# Altium schematic sheet BEAMFORMER.SchDoc (part 3 of 3)
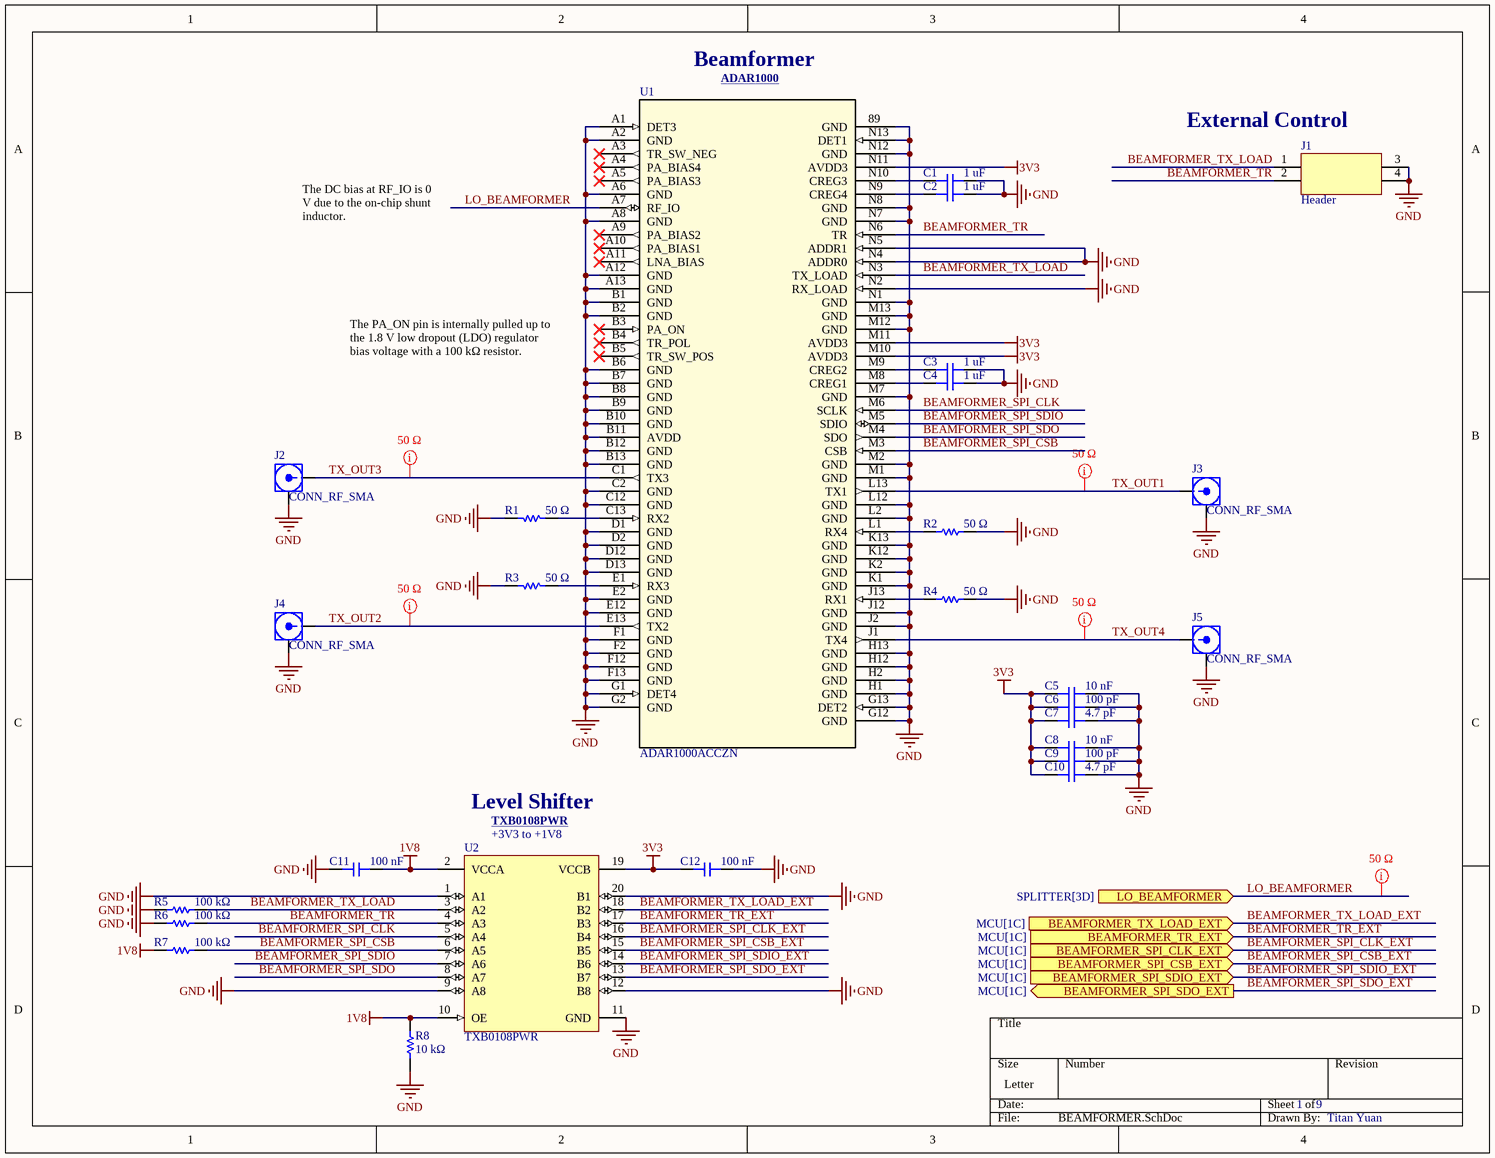
[diagram p2: BEAMFORMER.SchDoc]

## Library data of the parts (continued)
R8 = RES: Res Thick Film 0402 10K Ohm 1% 0.063W(1/16W) ±100ppm/C Pad SMD T/R; Manufacturer: Yageo; Manufacturer Part Number: RC0402FR-0710KL; Power Dissipation: 62.5mW; Power Rating: 63mW; Value: 10kΩ; Temperature Coefficient: 100ppm/°C; Voltage Rating (DC): 50V; Tolerance: 1%; Package Size: 0402; Supplier: DigiKey; Supplier Part Number: 311-10.0KLRCT-ND; RoHS: Compliant; Category: Chip SMD Resistors; Stock: 9059080; Pricing: 1=0.1, 10=0.012, 25=0.0092, 50=0.0062, 100=0.0056, 250=0.00472, 500=0.00328, 10000=0.00204, 20000=0.00153 (USD); Case/Package: 0402; Case Code (Imperial): 0402; Case Code (Metric): 0402; China RoHS: Non-Compliant; Composition: Thick Film; Country of Origin: Mainland China, Taiwan; Depth: 500µm; Export Control Classification Number (ECCN) Code: EAR99; Height: 350µm; Harmonized Tariff Schedule (HTS) Code: 8533.21.00.30; Introduction Date: 2004-10-04; Lead Free: Lead Free; Lead Pitch: 200µm; Length: 1mm; Lifecycle Status: Production; Max Operating Temperature: 155°C; Military Standard: Not; Min Operating Temperature: -55°C; Mounting Technology: Surface Mount; Pins: 2; Number of Terminals: 2; Number of Terminations: 2; Packaging: Tape & Reel; REACH SVHC: Yes; Schedule B: 8533210045, 8533210045|8533210045|8533210045|8533210045|8533210045|8533210045|8533210045|8533210045|8533210045|8533210045|8533210045|8533210045|8533210045|8533210045, 8533210045|8533210045|8533210045|8533210045|8533210045|8533210045|8533210045|8533210045|8533210045|8533210045|8533210045|8533210045|8533210045|8533210045|8533210045, 8533210045|8533210045|8533210045|8533210045|8533210045|8533210045|8533210045|8533210045|8533210045|8533210045|8533210045|8533210045|8533210045|8533210045|8533210045|8533210045; Termination: SMD/SMT; Width: 500µm; Working Voltage: 50V; ComponentLink1URL: https://datasheet.octopart.com:443/RC0402FR-0710KL-Yageo-datasheet-175887523.pdf?src-supplier=Newark; ComponentLink1Description: https://datasheet.octopart.com:443/RC0402FR-0710KL-Yageo-datasheet-175887523.pdf?src-supplier=Newark; ComponentLink2URL: https://datasheet.octopart.com:443/RC0402FR-0710KL-Yageo-datasheet-12531192.pdf?src-supplier=Newark; ComponentLink2Description: https://datasheet.octopart.com:443/RC0402FR-0710KL-Yageo-datasheet-12531192.pdf?src-supplier=Newark; ComponentLink3URL: https://datasheet.octopart.com:443/RC0402FR-0710KL-Yageo-datasheet-8324527.pdf?src-supplier=Newark; ComponentLink3Description: https://datasheet.octopart.com:443/RC0402FR-0710KL-Yageo-datasheet-8324527.pdf?src-supplier=Newark; ComponentLink4URL: https://datasheet.octopart.com:443/RC0402FR-0710KL-Yageo-datasheet-10408619.pdf?src-supplier=element14+APAC; ComponentLink4Description: https://datasheet.octopart.com:443/RC0402FR-0710KL-Yageo-datasheet-10408619.pdf?src-supplier=element14+APAC; ComponentLink5URL: https://datasheet.octopart.com:443/RC0402FR-0710KL-Yageo-datasheet-62067350.pdf?src-supplier=element14+APAC; ComponentLink5Description: https://datasheet.octopart.com:443/RC0402FR-0710KL-Yageo-datasheet-62067350.pdf?src-supplier=element14+APAC; ComponentLink6URL: https://datasheet.octopart.com:443/RC0402FR-0710KL-Yageo-datasheet-21426659.pdf?src-supplier=element14+APAC; ComponentLink6Description: https://datasheet.octopart.com:443/RC0402FR-0710KL-Yageo-datasheet-21426659.pdf?src-supplier=element14+APAC; ComponentLink7URL: https://datasheet.octopart.com:443/RC0402FR-0710KL-Yageo-datasheet-164759695.pdf?src-supplier=Upverter; ComponentLink7Description: https://datasheet.octopart.com:443/RC0402FR-0710KL-Yageo-datasheet-164759695.pdf?src-supplier=Upverter; ComponentLink8URL: https://datasheet.octopart.com:443/RC0402FR-0710KL-Yageo-datasheet-103092701.pdf?src-supplier=Upverter; ComponentLink8Description: https://datasheet.octopart.com:443/RC0402FR-0710KL-Yageo-datasheet-103092701.pdf?src-supplier=Upverter; ComponentLink9URL: https://sigma.octopart.com:443/138820526/technical_drawing/Yageo-RC0402FR-0710KL.pdf?src-supplier=Upverter; ComponentLink9Description: https://sigma.octopart.com:443/138820526/technical_drawing/Yageo-RC0402FR-0710KL.pdf?src-supplier=Upverter; ComponentLink10URL: https://datasheet.octopart.com:443/RC0402FR-0710KL-Yageo-datasheet-98239111.pdf?src-supplier=Upverter; ComponentLink10Description: https://datasheet.octopart.com:443/RC0402FR-0710KL-Yageo-datasheet-98239111.pdf?src-supplier=Upverter; ComponentLink11URL: https://datasheet.octopart.com:443/RC0402FR-0710KL-Yageo-datasheet-68298067.pdf?src-supplier=Upverter; ComponentLink11Description: https://datasheet.octopart.com:443/RC0402FR-0710KL-Yageo-datasheet-68298067.pdf?src-supplier=Upverter; ComponentLink12URL: https://datasheet.octopart.com:443/RC0402FR-0710KL-Yageo-datasheet-68297981.pdf?src-supplier=Upverter; ComponentLink12Description: https://datasheet.octopart.com:443/RC0402FR-0710KL-Yageo-datasheet-68297981.pdf?src-supplier=Upverter; ComponentLink13URL: https://datasheet.octopart.com:443/RC0402FR-0710KL-Yageo-datasheet-141435361.pdf?src-supplier=Upverter; ComponentLink13Description: https://datasheet.octopart.com:443/RC0402FR-0710KL-Yageo-datasheet-141435361.pdf?src-supplier=Upverter; ComponentLink14URL: https://datasheet.octopart.com:443/RC0402FR-0710KL-Yageo-datasheet-12509768.pdf?src-supplier=Upverter; ComponentLink14Description: https://datasheet.octopart.com:443/RC0402FR-0710KL-Yageo-datasheet-12509768.pdf?src-supplier=Upverter; ComponentLink15URL: https://datasheet.octopart.com:443/RC0402FR-0710KL-Yageo-Group-datasheet-190305687.pdf?src-supplier=Future+Electronics; ComponentLink15Description: https://datasheet.octopart.com:443/RC0402FR-0710KL-Yageo-Group-datasheet-190305687.pdf?src-supplier=Future+Electronics; ComponentLink16URL: https://datasheet.octopart.com:443/RC0402FR-0710KL-Yageo-datasheet-137700087.pdf?src-supplier=Future+Electronics; ComponentLink16Description: https://datasheet.octopart.com:443/RC0402FR-0710KL-Yageo-datasheet-137700087.pdf?src-supplier=Future+Electronics; ComponentLink17URL: https://datasheet.octopart.com:443/RC0402FR-0710KL-Yageo-datasheet-8324255.pdf?src-supplier=Future+Electronics; ComponentLink17Description: https://datasheet.octopart.com:443/RC0402FR-0710KL-Yageo-datasheet-8324255.pdf?src-supplier=Future+Electronics; ComponentLink18URL: https://datasheet.octopart.com:443/RC0402FR-0710KL-Yageo-datasheet-8329306.pdf?src-supplier=element14; ComponentLink18Description: https://datasheet.octopart.com:443/RC0402FR-0710KL-Yageo-datasheet-8329306.pdf?src-supplier=element14; ComponentLink19URL: https://datasheet.octopart.com:443/RC0402FR-0710KL-Yageo-datasheet-505231.pdf?src-supplier=element14; ComponentLink19Description: https://datasheet.octopart.com:443/RC0402FR-0710KL-Yageo-datasheet-505231.pdf?src-supplier=element14; ComponentLink20URL: https://datasheet.octopart.com:443/RC0402FR-0710KL-Yageo-datasheet-175423674.pdf?src-supplier=SOS+electronic; ComponentLink20Description: https://datasheet.octopart.com:443/RC0402FR-0710KL-Yageo-datasheet-175423674.pdf?src-supplier=SOS+electronic; ComponentLink21URL: https://datasheet.octopart.com:443/RC0402FR-0710KL-Yageo-datasheet-79472498.pdf?src-supplier=Megastar; ComponentLink21Description: https://datasheet.octopart.com:443/RC0402FR-0710KL-Yageo-datasheet-79472498.pdf?src-supplier=Megastar; ComponentLink22URL: https://datasheet.octopart.com/RC0402FR-0710KL-Yageo-datasheet-73766026.pdf; ComponentLink22Description: https://datasheet.octopart.com/RC0402FR-0710KL-Yageo-datasheet-73766026.pdf; ComponentLink23URL: http://sigma.octopart.com:80/conflict_mineral_statement/Yageo-company-3.pdf?src-supplier=Compliance+Statements; ComponentLink23Description: http://sigma.octopart.com:80/conflict_mineral_statement/Yageo-company-3.pdf?src-supplier=Compliance+Statements; ComponentLink24URL: http://sigma.octopart.com:80/rohs_statement/Yageo-company-2.pdf?src-supplier=Compliance+Statements; ComponentLink24Description: http://sigma.octopart.com:80/rohs_statement/Yageo-company-2.pdf?src-supplier=Compliance+Statements
U1 = ADAR1000ACCZN: 8 GHz to 16 GHz, 4-Channel, X Band and Ku Band Beamformer; Manufacturer_Name: Analog Devices Inc; Manufacturer: Analog Devices; Type: RF; Copyright: Copyright (C) 2025 Ultra Librarian. All rights reserved.; Manufacturer_Part_Number: ADAR1000ACCZN; RefDes: RefDes; Manufacturer Part Number: ADAR1000ACCZN
U2 = TXB0108PWR: 8-Bit Bidirectional Voltage-Level Shifter with Auto Direction Sensing and +/-15-kV ESD Protect 20-TSSOP -40 to 85; Manufacturer: Texas Instruments; Manufacturer Lifecycle Status: ACTIVE; Manufacturer Package Identifier: PW (R-PDSO-G**); Data Rate: 100Mbps; High Level Output Current: -20µA; Logic Function: Translator; Low Level Output Current: 20µA; Max Supply Voltage: 5.5V; Min Supply Voltage: 1.65V; Number of Bits: 8; Propagation Delay: 4ns; Quiescent Current: 3.5µA; Rise Time: 7.3ns; Topology: Push-Pull; Turn-On Delay Time: 9.5ns; Manufacturer Part Number: TXB0108PWR; Supplier: DigiKey; Supplier Part Number: 296-21527-1-ND; RoHS: Compliant; Category: Voltage Level Shifters; Stock: 22043; Pricing: 1=1.82, 10=1.338, 25=1.2176, 100=1.0851, 250=1.02184, 500=1.01132 (USD); Case/Package: TSSOP; Contact Plating: Gold; Height: 0m; Lead Free: Lead Free; Length: 6.5mm; Lifecycle Status: Production; Max Operating Temperature: 85°C; Min Operating Temperature: -40°C; Mounting Technology: Surface Mount; Number of Channels: 8; Number of Inputs: 8; Pins: 20; Output Current: 20µA; Radiation Hardening: No; REACH SVHC: No; Schedule B: 8542390000, 8542390000|8542390000|8542390000|8542390000|8542390000; Termination: SMD/SMT; Thickness: 1mm; Weight: 76.997305mg; Width: 4.4mm; ComponentLink1URL: https://sigma.octopart.com:443/157851284/technical_drawing/Texas-Instruments-TXB0108PWR.pdf?src-supplier=Texas+Instruments; ComponentLink1Description: https://sigma.octopart.com:443/157851284/technical_drawing/Texas-Instruments-TXB0108PWR.pdf?src-supplier=Texas+Instruments; ComponentLink2URL: https://octopart.com:443/opatz8j6/c1?t=LySuUYxN9QFMmqSZ0iSTBK1M-CfND3iA45F57-rgipnbsICCknTkoBhUukg2AkZDEL0aXzWd55iRogxa7qKL4TXUNFi6ipSyGXAAa9LZBdmP_Kv4vGBHh0qj-vgKaBFsF-d5KwYEI23cSnz-pp69Sgcy-_vsa0CB7mKhHXjctGx33TVX4QZBqIYpXxZkCgRNByv7fiJueXud0UX45YityO0p_-WYUGRJV_eJOGa4Ay7QQ8FZc3uEUNlVrkxXjQZMNFnbfnrSKCgesFBqhoNiKT25AC3yNUdmgJ7FLN5_z4zOzP0RR75DYkH4GMBnBzaYVRF7L7HNXVjS4Tp9-MFjD_sEQ-aCybQglHE52PnZL4JsgTDjFwelFwDtaMk_UKSdWjy_&src-supplier=Texas+Instruments; ComponentLink2Description: https://octopart.com:443/opatz8j6/c1?t=LySuUYxN9QFMmqSZ0iSTBK1M-CfND3iA45F57-rgipnbsICCknTkoBhUukg2AkZDEL0aXzWd55iRogxa7qKL4TXUNFi6ipSyGXAAa9LZBdmP_Kv4vGBHh0qj-vgKaBFsF-d5KwYEI23cSnz-pp69Sgcy-_vsa0CB7mKhHXjctGx33TVX4QZBqIYpXxZkCgRNByv7fiJueXud0UX45YityO0p_-WYUGRJV_eJOGa4Ay7QQ8FZc3uEUNlVrkxXjQZMNFnbfnrSKCgesFBqhoNiKT25AC3yNUdmgJ7FLN5_z4zOzP0RR75DYkH4GMBnBzaYVRF7L7HNXVjS4Tp9-MFjD_sEQ-aCybQglHE52PnZL4JsgTDjFwelFwDtaMk_UKSdWjy_&src-supplier=Texas+Instruments; ComponentLink3URL: https://datasheet.octopart.com:443/TXB0108PWR-Texas-Instruments-datasheet-34148259.pdf?src-supplier=Texas+Instruments; ComponentLink3Description: https://datasheet.octopart.com:443/TXB0108PWR-Texas-Instruments-datasheet-34148259.pdf?src-supplier=Texas+Instruments; ComponentLink4URL: https://datasheet.octopart.com:443/TXB0108PWR-Texas-Instruments-datasheet-11474939.pdf?src-supplier=Texas+Instruments; ComponentLink4Description: https://datasheet.octopart.com:443/TXB0108PWR-Texas-Instruments-datasheet-11474939.pdf?src-supplier=Texas+Instruments; ComponentLink5URL: https://datasheet.octopart.com:443/TXB0108PWR-Texas-Instruments-datasheet-10384694.pdf?src-supplier=Texas+Instruments; ComponentLink5Description: https://datasheet.octopart.com:443/TXB0108PWR-Texas-Instruments-datasheet-10384694.pdf?src-supplier=Texas+Instruments; ComponentLink6URL: https://datasheet.octopart.com:443/TXB0108PWR-Texas-Instruments-datasheet-10258393.pdf?src-supplier=Texas+Instruments; ComponentLink6Description: https://datasheet.octopart.com:443/TXB0108PWR-Texas-Instruments-datasheet-10258393.pdf?src-supplier=Texas+Instruments; ComponentLink7URL: https://sigma.octopart.com:443/49249835/technical_drawing/Texas-Instruments-TXB0108PWR.pdf?src-supplier=Texas+Instruments; ComponentLink7Description: https://sigma.octopart.com:443/49249835/technical_drawing/Texas-Instruments-TXB0108PWR.pdf?src-supplier=Texas+Instruments; ComponentLink8URL: https://datasheet.octopart.com:443/TXB0108PWR-Texas-Instruments-datasheet-37744618.pdf?src-supplier=Farnell; ComponentLink8Description: https://datasheet.octopart.com:443/TXB0108PWR-Texas-Instruments-datasheet-37744618.pdf?src-supplier=Farnell; ComponentLink9URL: https://datasheet.octopart.com:443/TXB0108PWR-Texas-Instruments-datasheet-8559414.pdf?src-supplier=Farnell; ComponentLink9Description: https://datasheet.octopart.com:443/TXB0108PWR-Texas-Instruments-datasheet-8559414.pdf?src-supplier=Farnell; ComponentLink10URL: https://datasheet.octopart.com:443/TXB0108PWR-Texas-Instruments-datasheet-5368061.pdf?src-supplier=Farnell; ComponentLink10Description: https://datasheet.octopart.com:443/TXB0108PWR-Texas-Instruments-datasheet-5368061.pdf?src-supplier=Farnell; ComponentLink11URL: https://datasheet.octopart.com:443/TXB0108PWR-Texas-Instruments-datasheet-66618004.pdf?src-supplier=Farnell; ComponentLink11Description: https://datasheet.octopart.com:443/TXB0108PWR-Texas-Instruments-datasheet-66618004.pdf?src-supplier=Farnell; ComponentLink12URL: https://datasheet.octopart.com:443/TXB0108PWR-Texas-Instruments-datasheet-48033010.pdf?src-supplier=Farnell; ComponentLink12Description: https://datasheet.octopart.com:443/TXB0108PWR-Texas-Instruments-datasheet-48033010.pdf?src-supplier=Farnell; ComponentLink13URL: https://datasheet.octopart.com:443/TXB0108PWR-Texas-Instruments-datasheet-10542789.pdf?src-supplier=Farnell; ComponentLink13Description: https://datasheet.octopart.com:443/TXB0108PWR-Texas-Instruments-datasheet-10542789.pdf?src-supplier=Farnell; ComponentLink14URL: https://datasheet.octopart.com:443/TXB0108PWR-Texas-Instruments-datasheet-151942.pdf?src-supplier=Upverter; ComponentLink14Description: https://datasheet.octopart.com:443/TXB0108PWR-Texas-Instruments-datasheet-151942.pdf?src-supplier=Upverter; ComponentLink15URL: https://datasheet.octopart.com:443/TXB0108PWR-Texas-Instruments-datasheet-11536343.pdf?src-supplier=Upverter; ComponentLink15Description: https://datasheet.octopart.com:443/TXB0108PWR-Texas-Instruments-datasheet-11536343.pdf?src-supplier=Upverter; ComponentLink16URL: https://datasheet.octopart.com:443/TXB0108PWR-Texas-Instruments-datasheet-33012939.pdf?src-supplier=element14+APAC; ComponentLink16Description: https://datasheet.octopart.com:443/TXB0108PWR-Texas-Instruments-datasheet-33012939.pdf?src-supplier=element14+APAC; ComponentLink17URL: https://datasheet.octopart.com:443/TXB0108PWR-Texas-Instruments-datasheet-165804950.pdf?src-supplier=LCSC; ComponentLink17Description: https://datasheet.octopart.com:443/TXB0108PWR-Texas-Instruments-datasheet-165804950.pdf?src-supplier=LCSC; ComponentLink18URL: https://datasheet.octopart.com:443/TXB0108PWR-Texas-Instruments-datasheet-159118386.pdf?src-supplier=LCSC; ComponentLink18Description: https://datasheet.octopart.com:443/TXB0108PWR-Texas-Instruments-datasheet-159118386.pdf?src-supplier=LCSC; ComponentLink19URL: https://datasheet.octopart.com:443/TXB0108PWR-Texas-Instruments-datasheet-137316104.pdf?src-supplier=Future+Electronics; ComponentLink19Description: https://datasheet.octopart.com:443/TXB0108PWR-Texas-Instruments-datasheet-137316104.pdf?src-supplier=Future+Electronics; ComponentLink20URL: https://datasheet.octopart.com:443/TXB0108PWR-Texas-Instruments-datasheet-14151550.pdf?src-supplier=iiiC; ComponentLink20Description: https://datasheet.octopart.com:443/TXB0108PWR-Texas-Instruments-datasheet-14151550.pdf?src-supplier=iiiC; ComponentLink21URL: https://datasheet.octopart.com:443/TXB0108PWR-Texas-Instruments-datasheet-126938.pdf?src-supplier=DigiKey; ComponentLink21Description: https://datasheet.octopart.com:443/TXB0108PWR-Texas-Instruments-datasheet-126938.pdf?src-supplier=DigiKey; ComponentLink22URL: http://sigma.octopart.com:80/reach_statement/Texas-Instruments-company-64.pdf?src-supplier=Compliance+Statements; ComponentLink22Description: http://sigma.octopart.com:80/reach_statement/Texas-Instruments-company-64.pdf?src-supplier=Compliance+Statements; ComponentLink23URL: http://sigma.octopart.com:80/conflict_mineral_statement/Texas-Instruments-company-63.pdf?src-supplier=Compliance+Statements; ComponentLink23Description: http://sigma.octopart.com:80/conflict_mineral_statement/Texas-Instruments-company-63.pdf?src-supplier=Compliance+Statements